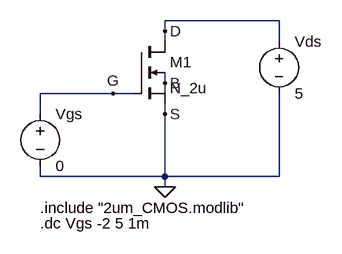
[diagram p0: schematic nmos.asc]
nmos.asc, the LTspice schematic file:
Version 4
SHEET 1 880 680
WIRE 336 0 160 0
WIRE 160 16 160 0
WIRE 160 32 160 16
WIRE 336 32 336 0
WIRE 160 96 160 80
WIRE 80 112 -32 112
WIRE 112 112 80 112
WIRE 160 112 160 96
WIRE -32 144 -32 112
WIRE 160 144 160 128
WIRE -32 240 -32 224
WIRE 160 240 160 144
WIRE 160 240 -32 240
WIRE 336 240 336 112
WIRE 336 240 160 240
WIRE 160 256 160 240
FLAG 160 16 D
FLAG 160 144 S
FLAG 80 112 G
FLAG 160 96 B
FLAG 160 256 0
SYMBOL nmos4 112 32 R0
SYMATTR InstName M1
SYMATTR Value N_2u
SYMATTR Value2 l=2 w=5
SYMBOL voltage 336 16 R0
WINDOW 123 0 0 Left 0
WINDOW 39 0 0 Left 0
SYMATTR InstName Vds
SYMATTR Value 5
SYMBOL voltage -32 128 R0
WINDOW 123 0 0 Left 0
WINDOW 39 0 0 Left 0
SYMATTR InstName Vgs
SYMATTR Value 0
TEXT -32 312 Left 2 !.dc Vgs -2 5 1m
TEXT -32 288 Left 2 !.include "2um_CMOS.modlib"

The netlist it stands for:
* nmos.asc
M1 D G 0 B N_2u l=2 w=5
Vds D 0 5
Vgs G 0 0
.model NMOS NMOS
.model PMOS PMOS
.lib standard.mos
.dc Vgs -2 5 1m
.include "2um_CMOS.modlib"
.backanno
.end